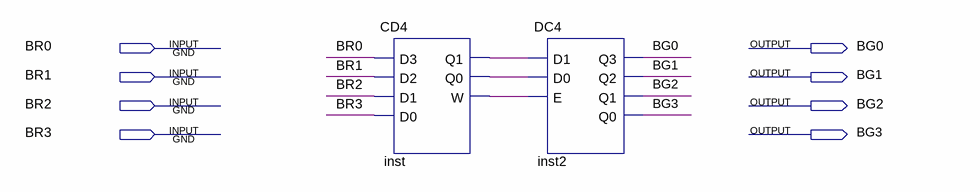
[diagram p0: schematic sheet]
// Quartus schematic Arbiter.bdf as structural Verilog: 2 symbols, 8 pins
module Arbiter (
  input  BR0,
  input  BR1,
  input  BR2,
  input  BR3,
  output BG0,
  output BG1,
  output BG2,
  output BG3
);

  wire inst_q0, inst_q1, inst_w;

  CD4 inst (.D3(BR0), .D2(BR1), .D1(BR2), .D0(BR3), .Q1(inst_q1), .Q0(inst_q0), .W(inst_w));
  DC4 inst2 (.D1(inst_q1), .D0(inst_q0), .E(inst_w), .Q3(BG0), .Q2(BG1), .Q1(BG2), .Q0(BG3));
endmodule
